# EAGLE design ArachnoMoto (EAGLE 6.5.0)
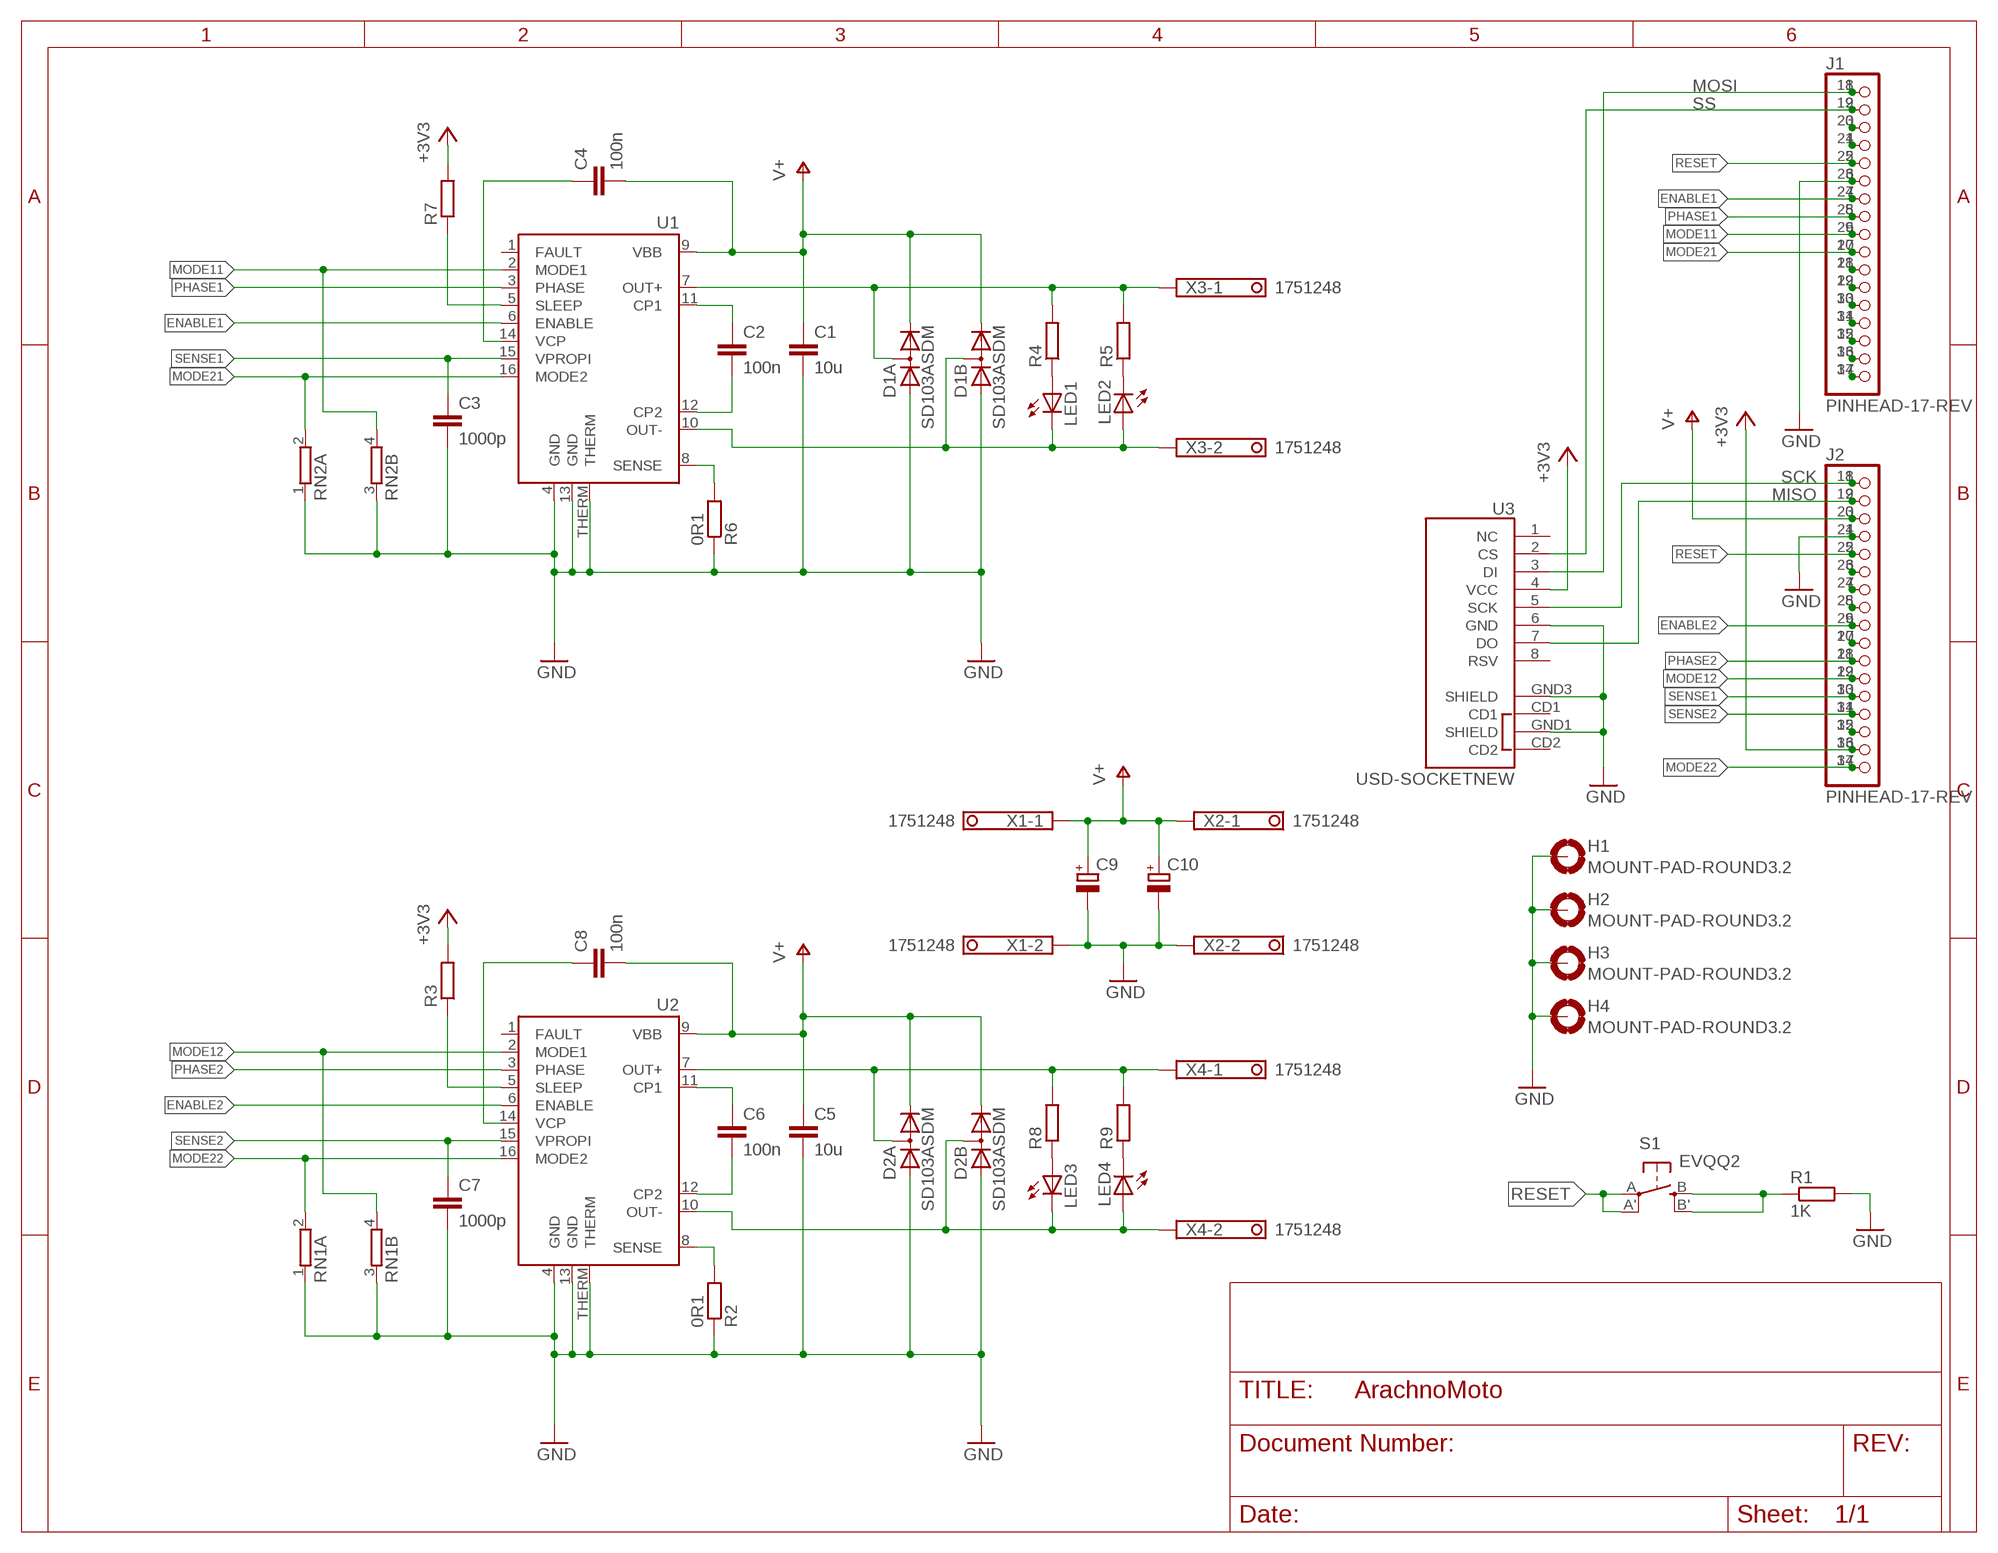
[diagram p0: schematic, sheet 1]

## Parts
C1  10u  C-EUC1210  [C1210]
C2  100n  C-EUC0603  [C0603]
C3  1000p  C-EUC0603  [C0603]
C4  100n  C-EUC0603  [C0603]
C5  10u  C-EUC1210  [C1210]
C6  100n  C-EUC0603  [C0603]
C7  1000p  C-EUC0603  [C0603]
C8  100n  C-EUC0603  [C0603]
C9  CPOL-EUE5-10.5  [E5-10,5]
C10  CPOL-EUE5-10.5  [E5-10,5]
D1  SD103ASDM  [SOT26]
D2  SD103ASDM  [SOT26]
H1  MOUNT-PAD-ROUND3.2  [3,2-PAD]
H2  MOUNT-PAD-ROUND3.2  [3,2-PAD]
H3  MOUNT-PAD-ROUND3.2  [3,2-PAD]
H4  MOUNT-PAD-ROUND3.2  [3,2-PAD]
J1  PINHEAD-17-REV  [4UCONN-12573]
J2  PINHEAD-17-REV  [4UCONN-12573]
LED1  LEDCHIP-LED0603  [CHIP-LED0603]
LED2  LEDCHIP-LED0603  [CHIP-LED0603]
LED3  LEDCHIP-LED0603  [CHIP-LED0603]
LED4  LEDCHIP-LED0603  [CHIP-LED0603]
R1  1K  R-EU_R1206  [R1206]
R2  0R1  R-EU_R1206  [R1206]
R3  R-EU_R0603  [R0603]
R4  R-EU_R0603  [R0603]
R5  R-EU_R0603  [R0603]
R6  0R1  R-EU_R1206  [R1206]
R7  R-EU_R0603  [R0603]
R8  R-EU_R0603  [R0603]
R9  R-EU_R0603  [R0603]
RN1  4R-NCTS742C083  [CTS742C083-RES]
RN2  4R-NCTS742C083  [CTS742C083-RES]
S1  EVQQ2  [EVQ-Q2]
U1  DRV8801  [HTSSOP16-PWP]
U2  DRV8801  [HTSSOP16-PWP]
U3  USD-SOCKETNEW  [MICRO-SD-SOCKET-PP]
X1  1751248  [1751248]
X2  1751248  [1751248]
X3  1751248  [1751248]
X4  1751248  [1751248]

## Nets
+3V3: J2.16 J2.33 R3.2 R7.2 U3.4(VCC)
AREF: J2.15 J2.32
D0: J1.4 J1.21
D1: J1.3 J1.20
D6: J1.11 J1.28
D7/SWDIO: J1.12 J1.29
ENABLE1: J1.7 J1.24 U1.6(ENABLE)
ENABLE2: J2.9 J2.26 U2.6(ENABLE)
ESP_RST: J2.8 J2.25
GND: C1.2 C3.2 C5.2 C7.2 C9.- C10.- D1.3(A:A) D1.6(B:A) D2.3(A:A) D2.6(B:A) H1.B3,2(MOUNT) H2.B3,2(MOUNT) H3.B3,2(MOUNT) H4.B3,2(MOUNT) J1.6 J1.23 J2.4 J2.21 R1.2 R2.1 R6.1 RN1.1 RN1.3 RN2.1 RN2.3 U1.4(GND) U1.13(GND) U1.THERM U2.4(GND) U2.13(GND) U2.THERM U3.6(GND) U3.GND1(SHIELD) U3.GND3(SHIELD) X1.2 X2.2
IO8/SWCLK: J1.13 J1.30
IO9: J1.14 J1.31
IO10: J1.15 J1.32
IO11: J1.16 J1.33
MISO: J2.2 J2.19 U3.7(DO)
MODE11: J1.9 J1.26 RN2.4 U1.2(MODE1)
MODE12: J2.12 J2.29 RN1.4 U2.2(MODE1)
MODE21: J1.10 J1.27 RN2.2 U1.16(MODE2)
MODE22: J2.17 J2.34 RN1.2 U2.16(MODE2)
MOSI: J1.1 J1.18 U3.3(DI)
N$1: D2.4(A:AC) R8.2 R9.2 U2.7(OUT+) X4.1
N$2: J1.17 J1.34
N$3: D2.1(B:AC) LED3.C LED4.A U2.10(OUT-) X4.2
N$4: LED1.A R4.1
N$5: C6.2 U2.12(CP2)
N$6: C6.1 U2.11(CP1)
N$7: R2.2 U2.8(SENSE)
N$8: R1.1 S1.B'(S1) S1.B(S)
N$9: C8.1 U2.14(VCP)
N$10: J2.6 J2.23
N$11: LED2.C R5.1
N$12: LED3.A R8.1
N$13: R3.1 U2.5(SLEEP)
N$14: LED4.C R9.1
N$18: D1.4(A:AC) R4.2 R5.2 U1.7(OUT+) X3.1
N$19: D1.1(B:AC) LED1.C LED2.A U1.10(OUT-) X3.2
N$20: C2.2 U1.12(CP2)
N$21: C2.1 U1.11(CP1)
N$22: R6.2 U1.8(SENSE)
N$23: C4.1 U1.14(VCP)
N$26: R7.1 U1.5(SLEEP)
NC: J2.10 J2.27
PHASE1: J1.8 J1.25 U1.3(PHASE)
PHASE2: J2.11 J2.28 U2.3(PHASE)
RESET: J1.5 J1.22 J2.5 J2.22 S1.A'(P1) S1.A(P)
SCK: J2.1 J2.18 U3.5(SCK)
SENSE1: C3.1 J2.13 J2.30 U1.15(VPROPI)
SENSE2: C7.1 J2.14 J2.31 U2.15(VPROPI)
SS: J1.2 J1.19 U3.2(CS)
TOUT: J2.7 J2.24
V+: C1.1 C4.2 C5.1 C8.2 C9.+ C10.+ D1.2(A:C) D1.5(B:C) D2.2(A:C) D2.5(B:C) J2.3 J2.20 U1.9(VBB) U2.9(VBB) X1.1 X2.1
Unconnected: RN1.5 RN1.6 RN1.7 RN1.8 RN2.5 RN2.6 RN2.7 RN2.8 U1.1(FAULT) U2.1(FAULT) U3.1(NC) U3.8(RSV) U3.CD1 U3.CD2

## Library data of the parts
C1-C8 = resistor:C-EU: CAPACITOR, European symbol
C9 C10 = resistor:CPOL-EU: POLARIZED CAPACITOR, European symbol
D1 D2 = logos-diodes:SD103ASDM: Digikey SD103ASDM-FDICT-ND
H1-H4 = holes:MOUNT-PAD-ROUND: MOUNTING PAD, round
J1 J2 = logos-headers:PINHEAD-17-REV
LED1-LED4 = adafruit:LED: LED OSRAM: - CHIPLED LG R971, LG N971, LY N971, LG Q971, LY Q971, LO R971, LY R971 LH N974, LH R974 LS Q976, LO Q976, LY Q976 LO Q996 - Hyper CHIPLED LW Q18S LB Q993, LB Q99A, LB R99A - SideLED LS A670, LO A670, LY A670, LG A670, LP A670 LB A673, LV A673, LT A673, LW A673 LH A674 LY A675 LS A676, LA A676, LO A676, LY A676, LW A676 LS A679, LY A679, LG A679 - Hyper Micro SIDELED® LS Y876, LA Y876, LO Y876, LY Y876 LT Y87S - SmartLED LW L88C, LW L88S LB L89C, LB L89S, LG L890 LS L89K, LO L89K, LY L89K LS L896, LA L896, LO L896, LY L896 - TOPLED LS T670, LO T670, LY T670, LG T670, LP T670 LSG T670, LSP T670, LSY T670, LOP T670, LYG T670 LG T671, LOG T671, LSG T671 LB T673, LV T673, LT T673, LW T673 LH T674 LS T676, LA T676, LO T676, LY T676, LB T676, LH T676, LSB T676, LW T676 LB T67C, LV T67C, LT T67C, LS T67K, LO T67K, LY T67K, LW E67C LS E67B, LA E67B, LO E67B, LY E67B, LB E67C, LV E67C, LT E67C LW T67C LS T679, LY T679, LG T679 LS T770, LO T770, LY T770, LG T770, LP T770 LB T773, LV T773, LT T773, LW T773 LH T774 LS E675, LA E675, LY E675, LS T675 LS T776, LA T776, LO T776, LY T776, LB T776 LHGB T686 LT T68C, LB T68C - Hyper Mini TOPLED® LB M676 - Mini TOPLED Santana® LG M470 LS M47K, LO M47K, LY M47K Source: http://www.osram.convergy.de/
R1-R9 = resistor:R-EU_: RESISTOR, European symbol
RN1 RN2 = res-cap-arrays:4R-N: Array Chip Resistor Source: RS Component / Phycomp
S1 = adafruit:EVQQ2: SMT 6mm switch, EVQQ2 series http://www.ladyada.net/library/eagle
U1 U2 = ti-stuff:DRV8801
U3 = SparkFun-Connectors:USD-SOCKET: microSD Socket Push-push type uSD socket. Schematic element and footprint production proven. Spark Fun Electronics SKU : PRT-00127. tDoc lines correctly indicate media card edge positions when inserting (unlocked, locked, depressed). NOTE: CD1 and CD2 are connected internally; PROD_ID: CONN-07820
X1-X4 = con-phoenix-350:1751248: MKDS 1/ 2-3,5 Printklemme Nennstrom: 10 A Bemessungsspannung: 160 V Raster: 3,5 mm Polzahl: 2 Montageart: Löten Anschlussart: Schraubanschluss Anschlussrichtung vom Leiter zur Platine: 0° Source: http://eshop.phoenixcontact.com .. 1751248.pdf; OC_FARNELL: unknown; OC_NEWARK: unknown

## Board
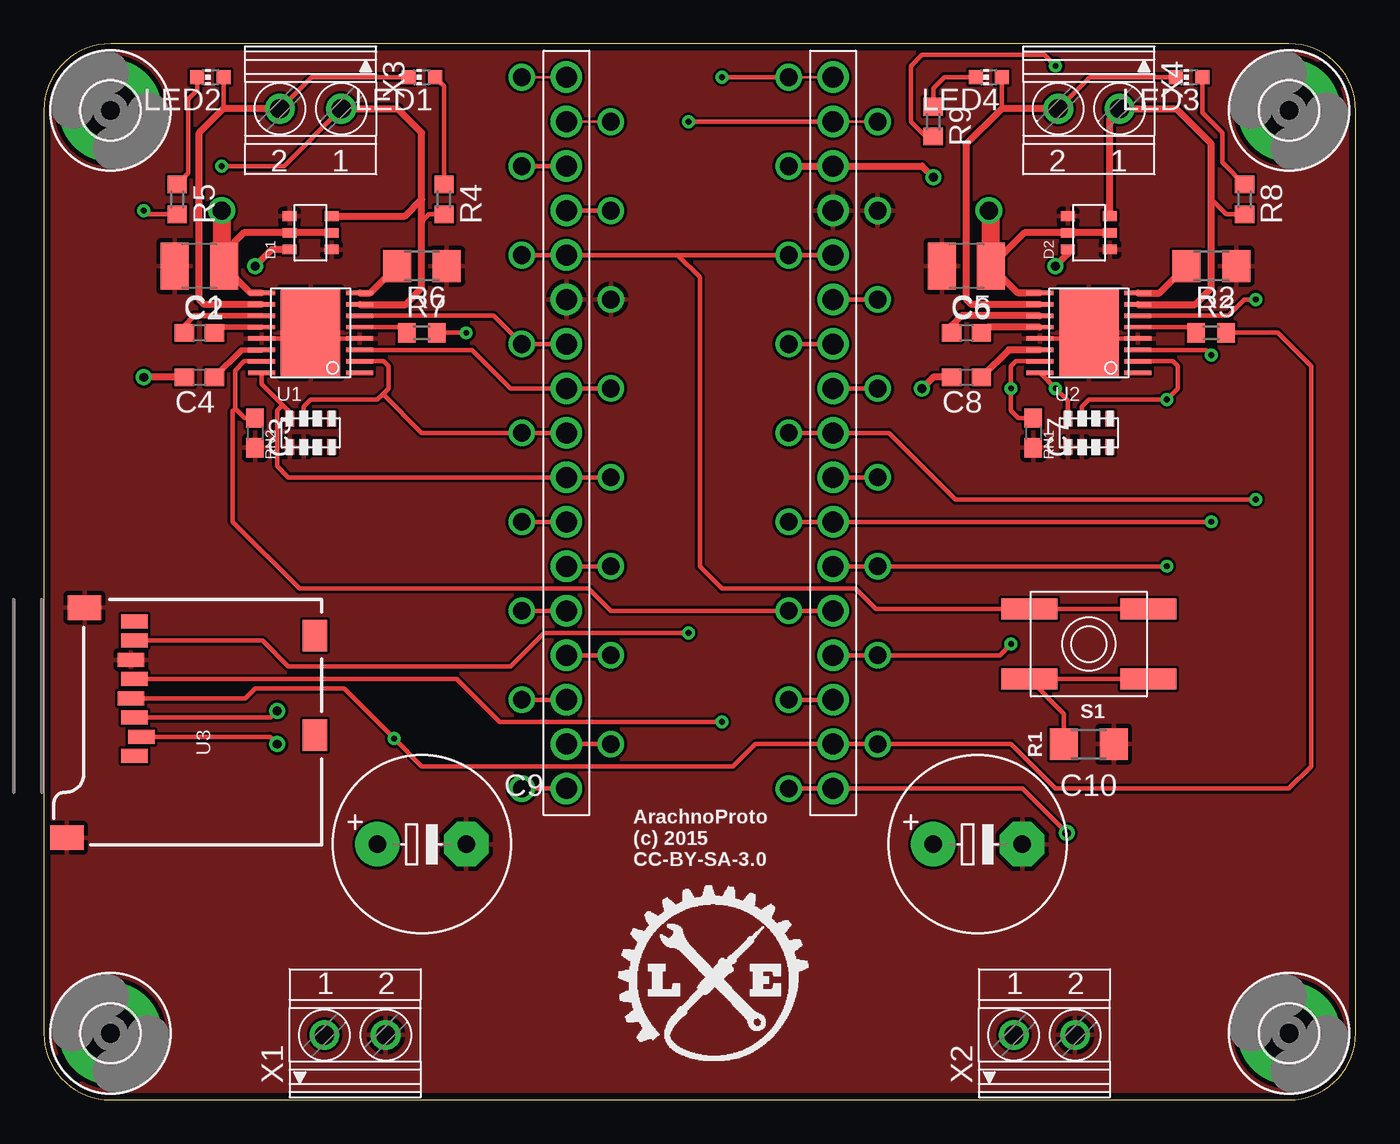
[diagram p1: board, top side]
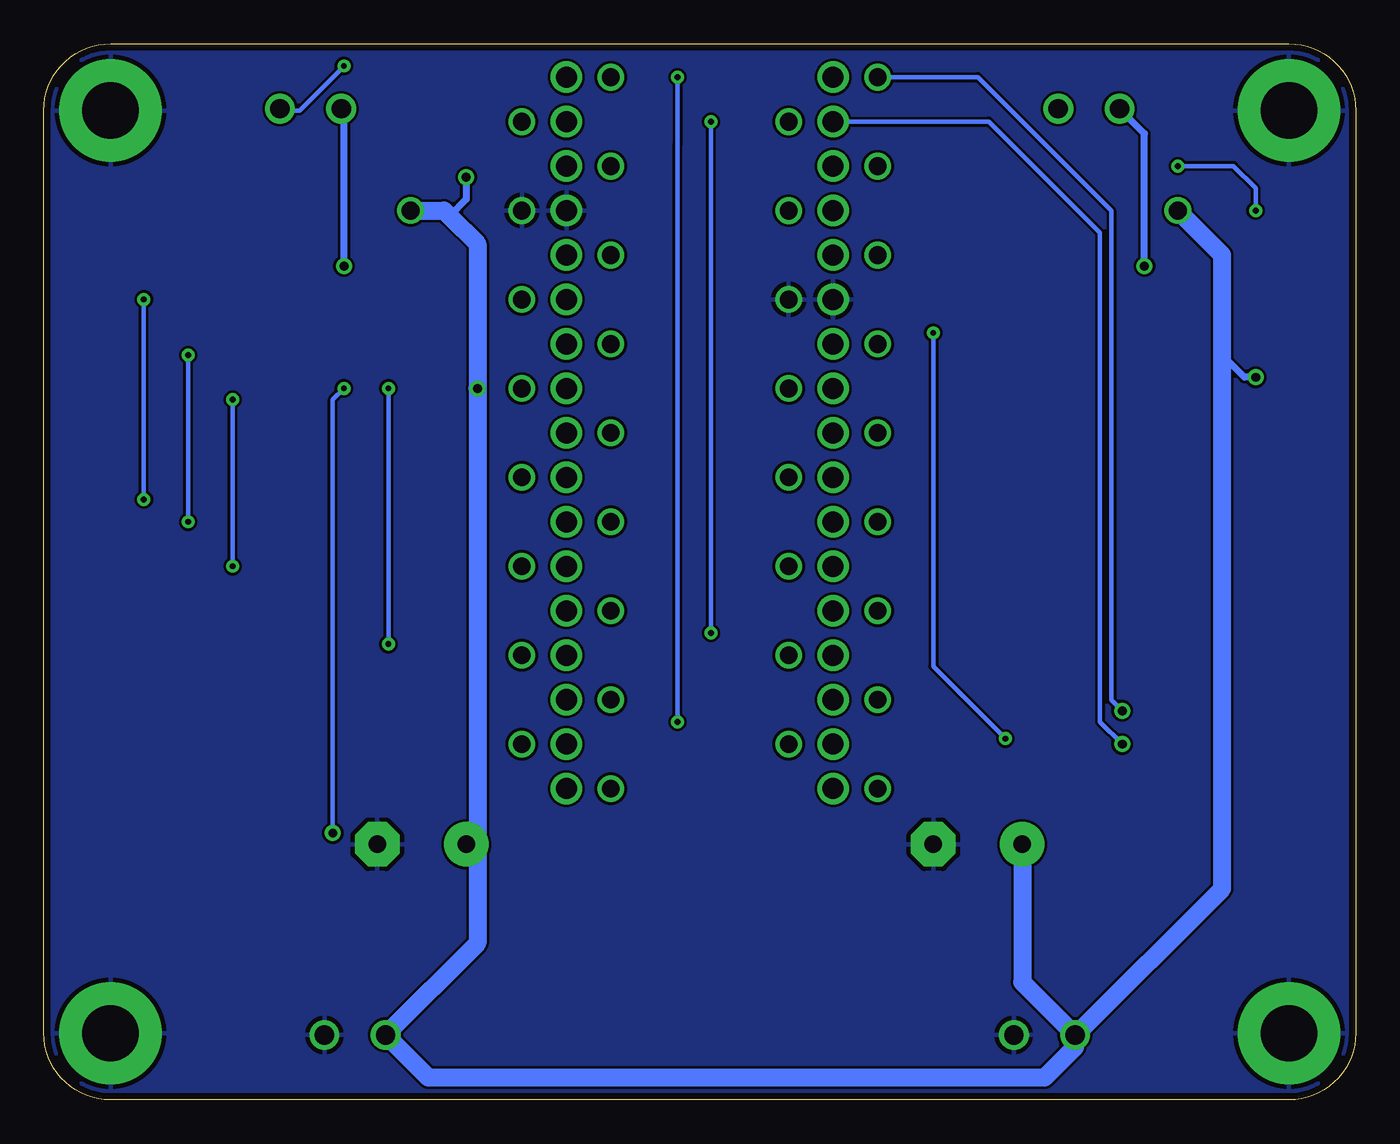
[diagram p2: board, bottom side, seen from below]

Size 74.93 x 60.33 mm. Coordinates in mm from the lower left corner, seen from the top.
Outline: 71.12,60.33 3.81,60.33 arc90 0,56.52 0,3.81 arc90 3.81,0 71.12,0 arc90 74.93,3.81 74.93,56.52 arc90 71.12,60.33
Copper layers (1*16): Top 0.035mm / dielectric 1.5mm / Bottom 0.035mm
Design rules "default *": minimum track width 6mil, minimum drill 13mil, track to track 6mil, track to pad 6mil, pad to pad 6mil, via to via 6mil, smd to smd 6mil, copper to edge 15mil, drill to drill 15mil, minimum pad ring 10mil, minimum via ring 8mil, stop-mask expansion 4mil, vias tented up to drill 0mil, thermal gap 10mil

### Footprints (pad centres in the part's own frame; a part is rotated, then mirrored left to right if it is on the bottom)
C1210 = smd 1.6 x 2.7: 1 -1.4,0; 2 1.4,0
C0603 = smd 1.1 x 1: 1 -0.85,0; 2 0.85,0
E5-10,5 = drill 1.016 pad 2.54: + -2.54,0 | drill 1.016 pad 2.54 octagon: - 2.54,0
SOT26 = smd 0.55 x 0.8: 1 -0.95,1.2; 2 0,1.2; 3 0.95,1.2; 4 0.95,-1.2; 5 0,-1.2; 6 -0.95,-1.2
3,2-PAD = drill 3.2 pad 5.842: B3,2 0,0
4UCONN-12573 = drill 1.2: 1 -20.32,0; 2 -17.78,0; 3 -15.24,0; 4 -12.7,0; 5 -10.16,0; 6 -7.62,0; 7 -5.08,0; 8 -2.54,0; 9 0,0; 10 2.54,0; 11 5.08,0; 12 7.62,0; 13 10.16,0; 14 12.7,0; 15 15.24,0; 16 17.78,0; 17 20.32,0 | drill 1.02: 18 -20.32,-2.54; 19 -17.78,2.54; 20 -15.24,-2.54; 21 -12.7,2.54; 22 -10.16,-2.54; 23 -7.62,2.54; 24 -5.08,-2.54; 25 -2.54,2.54; 26 0,-2.54; 27 2.54,2.54; 28 5.08,-2.54; 29 7.62,2.54; 30 10.16,-2.54; 31 12.7,2.54; 32 15.24,-2.54; 33 17.78,2.54; 34 20.32,-2.54
CHIP-LED0603 = smd 0.8 x 0.8: A 0,-0.75; C 0,0.75
R1206 = smd 1.6 x 1.803: 1 -1.422,0; 2 1.422,0
R0603 = smd 1 x 1.1: 1 -0.85,0; 2 0.85,0
CTS742C083-RES = smd 0.9 x 0.5: 1 -0.8,1.2; 2 0.8,1.2; 3 -0.8,0.4; 4 0.8,0.4; 5 -0.8,-0.4; 6 0.8,-0.4; 7 -0.8,-1.2; 8 0.8,-1.2
EVQ-Q2 = smd 3.2 x 1.2: A -3.4,-2; A' 3.4,-2; B -3.4,2; B' 3.4,2
HTSSOP16-PWP = smd 0.25 x 1.55: 1 -2.275,-2.8; 2 -1.625,-2.8; 3 -0.975,-2.8; 4 -0.325,-2.8; 5 0.325,-2.8; 6 0.975,-2.8; 7 1.625,-2.8; 8 2.275,-2.8; 9 2.275,2.8; 10 1.625,2.8; 11 0.975,2.8; 12 0.325,2.8; 13 -0.325,2.8; 14 -0.975,2.8; 15 -1.625,2.8; 16 -2.275,2.8 | smd 5 x 3.4: THERM 0,0
MICRO-SD-SOCKET-PP = smd 0.8 x 1.5: 1 -8.94,10.7; 2 -7.84,10.3; 3 -6.74,10.7; 4 -5.64,10.9; 5 -4.54,10.7; 6 -3.44,10.9; 7 -2.34,10.7; 8 -1.24,10.7 | smd 1.8 x 1.4: CD1 -2.05,0.4; CD2 -7.75,0.4 | smd 1.4 x 1.9: GND1 -13.6,14.55; GND3 -0.45,13.55
1751248 = drill 1.1 pad 1.7: 1 -1.75,-0.1; 2 1.75,-0.1

### Placement (x,y rotation side)
C1  8.89,47.62 180 top
C2  8.89,43.81 0 top
C3  12.06,38.1 270 top
C4  8.89,41.27 180 top
C5  52.7,47.62 180 top
C6  52.7,43.81 0 top
C7  56.52,38.1 270 top
C8  52.7,41.27 180 top
C9  21.59,14.61 0 top
C10  53.34,14.61 0 top
D1  15.24,49.53 90 top
D2  59.69,49.53 90 top
H1  3.81,3.81 270 top
H2  3.81,56.52 270 top
H3  71.12,3.81 270 top
H4  71.12,56.52 270 top
J1  29.84,38.1 270 top
J2  45.09,38.1 270 top
LED1  21.59,58.42 90 top
LED2  9.53,58.42 90 top
LED3  65.41,58.42 90 top
LED4  53.98,58.42 90 top
R1  59.69,20.32 0 top
R2  66.67,47.62 180 top
R3  66.67,43.81 0 top
R4  22.86,51.44 270 top
R5  7.62,51.44 270 top
R6  21.59,47.62 180 top
R7  21.59,43.81 0 top
R8  68.58,51.44 270 top
R9  50.8,55.88 270 top
RN1  59.69,38.1 90 top
RN2  15.24,38.1 90 top
S1  59.69,26.04 180 top
U1  15.24,43.81 90 top
U2  59.69,43.81 90 top
U3  15.88,28.57 90 top
U$1  [LOGO-SM]  32.38,1.91 0 top
X1  17.78,3.81 0 top
X2  57.15,3.81 0 top
X3  15.24,56.52 180 top
X4  59.69,56.52 180 top

### Tracks (layer width: path | path; a pad name or v marks a point on that pad's centre or on a via)
+3V3  (via drill 0.33)
  Top 0.254: R3.2 70.48,43.81 72.39,41.91 72.39,19.05 71.12,17.78 57.78,17.78 55.24,20.32 J2.33 J2.16 40.64,20.32 39.37,19.05 21.59,19.05 v20,20.64 17.14,23.5 12.06,23.5 11.51,22.93 U3.4 | R7.2 v24.13,43.81
  Bottom 0.254: v24.13,43.81 24.13,24.77 v20,20.64
AREF
  Top 0.254: J2.32 J2.15
D0
  Top 0.254: J1.21 J1.4
D1
  Top 0.254: J1.3 J1.20
D6
  Top 0.254: J1.11 J1.28
D7/SWDIO
  Top 0.254: J1.12 J1.29
ENABLE1
  Top 0.254: U1.6 25.7,44.79 J1.24 J1.7
ENABLE2  (via drill 0.33)
  Top 0.254: J2.26 J2.9 48.26,38.1 52.07,34.29 v69.22,34.29 | v69.22,45.72 68.58,45.72 67.65,44.79 U2.6
  Bottom 0.254: v69.22,34.29 v69.22,45.72
ESP_RST
  Top 0.254: J2.8 J2.25
GND
  Top 0.254: U1.13 14.91,43.49 U1.THERM 15.56,43.49 U1.4 | U2.13 59.37,43.49 U2.THERM 60.02,43.49 U2.4
  pour Top: 0,60.33 0,0 74.93,0 74.93,60.33
  pour Bottom: 74.93,60.33 74.93,0 0,0 0,60.33
IO8/SWCLK
  Top 0.254: J1.13 J1.30
IO9
  Top 0.254: J1.14 J1.31
IO10
  Top 0.254: J1.15 J1.32
IO11
  Top 0.254: J1.16 J1.33
MISO  (via drill 0.33)
  Top 0.152: J2.19 J2.2
  Top 0.254: U3.7 12.5,26.23 13.97,24.77 26.67,24.77 28.57,26.67 v36.83,26.67 | v36.83,55.88 J2.2
  Bottom 0.254: v36.83,26.67 v36.83,55.88
MODE11
  Top 0.254: RN2.4 14.84,39.6 15.24,40.01 19.05,40.01 19.37,40.32 | 19.37,40.32 19.68,40.64 19.68,41.91 19.41,42.19 U1.2 | J1.9 J1.26 21.59,38.1 19.37,40.32
MODE12  (via drill 0.33)
  Top 0.254: RN1.4 59.29,39.6 59.69,40.01 63.5,40.01 v64.14,40.01 64.77,40.64 64.77,41.91 64.49,42.19 U2.2 | J2.12 J2.29 v64.14,30.48
  Bottom 0.254: v64.14,30.48 v64.14,40.01
MODE21
  Top 0.254: U1.16 12.44,40.9 13.65,39.69 | 13.65,39.69 14.04,39.3 RN2.2 | J1.27 J1.10 13.97,35.56 13.34,36.2 13.34,39.37 13.65,39.69
MODE22  (via drill 0.33, 0.51)
  Top 0.254: RN1.2 58.49,39.94 v57.78,40.64 | v57.78,40.64 U2.16 v57.78,40.65 v57.78,40.64 | J2.34 J2.17 55.88,17.78 v58.42,15.24
  Bottom 0.254: v58.42,15.24 58.42,40.01 v57.78,40.64
MOSI  (via drill 0.51)
  Top 0.152: J1.1 J1.18
  Top 0.254: U3.3 12.95,21.84 v13.34,22.23
  Bottom 0.254: J1.18 21.59,58.42 13.97,50.8 13.97,22.86 v13.34,22.23
N$1  (via drill 0.33)
  Top 0.254: R8.2 67.53,50.59 66.67,51.44 | R9.2 50.38,55.03 49.53,55.88 49.53,59.05 50.16,59.69 57.15,59.69 v57.78,59.05
  Top 0.406: U2.7 65.76,45.44 66.67,46.35 66.67,51.44 66.67,54.61 64.67,56.62 X4.1 60.89,56.06 D2.4
  Bottom 0.254: v57.78,59.05 60.33,56.52 61.34,56.52 X4.1
N$2
  Top 0.254: J1.17 J1.34
N$3  (via drill 0.51)
  Top 0.254: LED4.A 54.73,56.63 54.61,56.52 | LED3.C 59.74,58.42 X4.2
  Top 0.406: U2.10 52.98,45.44 52.7,45.72 52.7,54.61 54.61,56.52 54.71,56.62 X4.2 | D2.1 58.49,48.33 v57.78,47.62
  Bottom 0.406: v57.78,47.62 57.78,56.46 X4.2
N$4
  Top 0.254: R4.1 22.86,57.9 LED1.A
N$5
  Top 0.406: U2.12 53.88,44.14 C6.2
N$6
  Top 0.406: U2.11 52.41,44.79 51.85,44.23 C6.1
N$7
  Top 0.406: U2.8 63.72,46.09 R2.2
N$8
  Top 0.254: R1.1 58.27,22.06 S1.B' S1.B
N$9
  Top 0.406: U2.14 55.12,42.84 C8.1
N$10
  Top 0.254: J2.23 J2.6
N$11
  Top 0.254: LED2.C 8.78,57.67 8.26,57.15 8.26,52.92 R5.1
N$12
  Top 0.254: LED3.A 66.16,56.4 67.31,55.24 67.31,53.55 R8.1
N$13
  Top 0.254: U2.5 65.5,44.14 R3.1
N$14
  Top 0.254: LED4.C 51.44,58.42 50.8,57.78 R9.1
N$18  (via drill 0.33)
  Top 0.254: R4.2 22.01,50.59 21.59,50.16 | R5.2 5.93,50.59 v5.71,50.8 | v10.16,53.34 13.71,53.34 X3.1
  Top 0.406: U1.7 20.68,45.44 21.59,46.35 21.59,50.16 21.59,51.44 | 21.59,51.44 21.59,55.24 20.22,56.62 X3.1 | D1.4 20.64,50.48 21.59,51.44
  Bottom 0.254: v5.71,50.8 5.71,52.07 6.99,53.34 v10.16,53.34
N$19  (via drill 0.51)
  Top 0.254: LED2.A 10.28,56.63 10.26,56.62 | LED1.C 15.29,58.42 X3.2
  Top 0.406: U1.10 9.17,45.44 8.89,45.72 8.89,55.24 10.26,56.62 X3.2 | D1.1 13.02,48.58 v12.06,47.62
  Bottom 0.406: v12.06,47.62 12.06,55.19 X3.2
N$20
  Top 0.305: U1.12 10.06,44.14 C2.2
N$21
  Top 0.305: U1.11 8.6,44.79 8.04,44.23 C2.1
N$22
  Top 0.406: U1.8 18.63,46.09 R6.2
N$23
  Top 0.305: U1.14 11.3,42.84 C4.1
N$26
  Top 0.254: U1.5 20.41,44.14 R7.1
NC
  Top 0.254: J2.10 J2.27
PHASE1
  Top 0.254: U1.3 24.47,42.84 26.67,40.64 J1.8 J1.25
PHASE2  (via drill 0.33)
  Top 0.254: J2.28 J2.11 v66.67,33.02 | U2.3 66.38,42.84 v66.67,42.55
  Bottom 0.254: v66.67,33.02 v66.67,42.55
RESET
  Top 0.254: J1.22 J1.5 36.2,48.26 | 36.2,48.26 J2.22 J2.5 | S1.A S1.A' 47.53,28.04 46.35,29.21 38.73,29.21 37.47,30.48 37.47,46.99 36.2,48.26
SCK  (via drill 0.33)
  Top 0.152: J2.1 J2.18
  Top 0.254: U3.5 23.59,24.04 26.04,21.59 v38.73,21.59 | J2.18 v38.73,58.42
  Bottom 0.254: v38.73,21.59 38.73,54.61 v38.73,58.42
SENSE1
  Top 0.254: U1.15 11.46,42.19 10.92,41.66 10.92,39.5 | 10.92,39.5 11.47,38.95 C3.1 | J2.13 J2.30 32.38,27.94 31.11,29.21 14.61,29.21 10.79,33.02 10.79,39.37 10.92,39.5
SENSE2  (via drill 0.33)
  Top 0.254: U2.15 55.52,42.19 55.24,41.91 55.24,41.27 v55.24,40.64 55.24,39.37 55.66,38.95 C7.1 | J2.14 J2.31 54.61,25.4 v55.24,26.04
  Bottom 0.254: v55.24,26.04 v55.24,40.64
SS  (via drill 0.51)
  Top 0.152: J1.19 J1.2
  Top 0.254: U3.2 12.92,20.73 v13.34,20.32
  Bottom 0.254: J1.2 20.95,55.88 14.61,49.53 14.61,21.59 v13.34,20.32
TOUT
  Top 0.254: J2.7 J2.24
V+  (via drill 0.51, 1.02)
  Top 0.406: U1.9 11.82,46.09 C1.1 10.29,48.39 11.43,49.53 D1.2 D1.5 | C4.2 v5.71,41.27 | U2.9 55.64,46.09 C5.1 56.01,49.53 D2.2 D2.5 | C8.2 50.8,41.27 v50.16,40.64 | J2.20 J2.3 50.16,53.34 v50.8,52.7
  Top 1.016: v10.16,50.8 10.16,47.76 C1.1 | C5.1 54.1,50.67 v53.98,50.8
  Bottom 0.406: v5.71,41.27 6.35,41.27 7.62,42.55 | v50.8,52.7 50.8,51.44 51.75,50.48
  Bottom 1.016: X1.1 16.03,3.02 17.78,1.27 52.96,1.27 X2.1 50.16,8.95 50.16,13.97 | X1.1 15.97,3.71 7.62,12.06 7.62,42.55 7.62,48.26 v10.16,50.8 | v53.98,50.8 52.07,50.8 51.75,50.48 50.16,48.9 v50.16,40.64 50.16,13.97 | C9.+ 19.05,6.73 X1.1 | C10.+ 50.16,13.97

### Text on the board
tPlace: ArachnoProto / (c) 2015 / CC-BY-SA-3.0